# Altium project PCB_Project.PrjPcb (part 1 of 2)
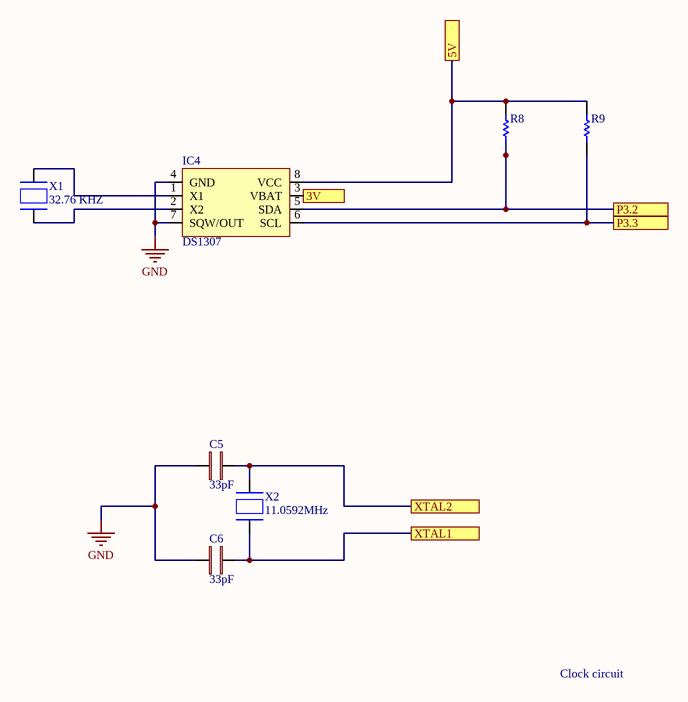
[diagram p0: Clock-management.SchDoc]
6 sheets, 57 parts. Net scope: flat (ports and power ports of the same name join across sheets).
Board file: PCB1.PcbDoc
Sheets:
  Clock-management.SchDoc
  Battery-management.SchDoc
  FTDI-support.SchDoc
  XC888.SchDoc
  Button-connections.SchDoc
  Interfaces.SchDoc

## Sheet Clock-management.SchDoc
size A4; SheetNumber: 1; SheetTotal: 6

### Parts
C5  33pF  [250R07S330JV4T]
C6  33pF  [250R07S330JV4T]
IC4  DS1307  [DS1307]
R8  RC0805FR-0710KL  [RESC2013X60X35NL10T20]  (value not drawn)
R9  RC0805FR-0710KL  [RESC2013X60X35NL10T20]  (value not drawn)
X1  32.76 KHZ  [FC-12M]
X2  11.0592MHz  [HC-49/SM]

### Ports
3V, 5V, P3.2, P3.3, XTAL1, XTAL2

### Nets
GND: C5.2 C6.2 IC4.4(GND) IC4.7(SQW/OUT)
NetBAT_1: IC4.3(VBAT) ; port 3V
NetC4_1: IC4.8(VCC) R8.2 R9.2 ; port 5V
NetC5_1: C5.1 X2.2 ; port XTAL2
NetC6_1: C6.1 X2.1 ; port XTAL1
NetIC4_1: IC4.1(X1) X1.1
NetIC4_2: IC4.2(X2) X1.2
NetIC4_5: IC4.5(SDA) R8.1 ; port P3.2
NetIC4_6: IC4.6(SCL) R9.1 ; port P3.3

### Notes on the sheet
- Clock circuit

### Library data of the parts
C5 C6 = 500R07S330JV4T: Cap Ceramic 33pF 50V C0G 5% Pad SMD 0402 125°C Ultra Low ESR T/R; Manufacturer: Johanson; Supplier 1: Newark; Manufacturer Part Number: 500R07S330JV4T; RoHS: Yes; Category: Ceramic Capacitors; Stock 1: 2779; Pricing 1: 1=0,22000, 10=0,15400, 25=0,12900, 50=0,10400, 100=0,07900 (USD); Mount: Surface Mount; Case/Package: 0402; Case Code (Metric): 1005; Case Code (Imperial): 0402; Min Operating Temperature: -55°C; Max Operating Temperature: 125°C; Dielectric: C0G; Capacitance: 33pF; Tolerance: 5%; Voltage Rating: 50V; Packaging: Tape and Reel; Voltage Rating (DC): 50V; Termination: SMD/SMT; Package Quantity: 1; Length: 1.02mm; Width: 0.02inch; Height: 0.64mm; Depth: 0.51mm; Thickness: 0.024inch; REACH SVHC: No SVHC; ComponentLink1URL: https://datasheet.ciiva.com/46417/1731432-46417670.pdf?src-supplier=Element14; ComponentLink1Description: https://datasheet.ciiva.com/46417/1731432-46417670.pdf?src-supplier=Element14; Supplier Part Number 1: 51Y5225
IC4 = DS1307ZNTR: IC RTC SERIAL 512K IND 8-SOIC; Manufacturer: Maxim; Logic Function: Clock; Time Format: HH:MM:SS; Operating Supply Voltage: 5V; Memory Size: 56B; Max Supply Voltage: 5.5V; Min Supply Voltage: 4.5V; Interface: I2C,Serial,2-Wire; Date Format: YY-MM-DD-dd; Voltage: 7V; Supplier 1: Digi-Key; Manufacturer Part Number: DS1307ZNTR; RoHS: Yes; Category: Real Time Clocks; Mount: Surface Mount; Case/Package: SOIC; Number of Pins: 8; Weight: 0.019048oz; Contact Plating: Tin,Matte; Min Operating Temperature: -40°C; Max Operating Temperature: 85°C; Packaging: Tape and Reel; Package Quantity: 2500; Series: -; Radiation Hardening: No; Lead Free: Lead Free; REACH SVHC: Unknown; ComponentLink1URL: https://datasheet.ciiva.com/1243/ds1307-1243264.pdf?src-supplier=Digi-Key; ComponentLink1Description: https://datasheet.ciiva.com/1243/ds1307-1243264.pdf?src-supplier=Digi-Key; ComponentLink2URL: https://datasheet.ciiva.com/18633/ds1307-18633131.pdf?src-supplier=Digi-Key; ComponentLink2Description: https://datasheet.ciiva.com/18633/ds1307-18633131.pdf?src-supplier=Digi-Key; ComponentLink3URL: https://datasheet.ciiva.com/3304/ds1307-3304460.pdf?src-supplier=Avnet; ComponentLink3Description: https://datasheet.ciiva.com/3304/ds1307-3304460.pdf?src-supplier=Avnet; ComponentLink4URL: https://datasheet.ciiva.com/18633/ds1307-18633132.pdf?src-supplier=Digi-Key; ComponentLink4Description: https://datasheet.ciiva.com/18633/ds1307-18633132.pdf?src-supplier=Digi-Key; ComponentLink5URL: https://datasheet.ciiva.com/28652/1647366-28652551.pdf?src-supplier=Element14; ComponentLink5Description: https://datasheet.ciiva.com/28652/1647366-28652551.pdf?src-supplier=Element14; Supplier Part Number 1: DS1307ZN+T&R-ND
R8 R9 = CMP-1659-00013-4: Chip Resistor, 10 KOhm, +/- 1%, 0.125 W, -55 to 155 degC, 0805 (2012 Metric), RoHS, Tape and Reel; Manufacturer: Yageo; Voltage Rating: 150 V; Mount: Surface Mount; ComponentLink1Description: Manufacturer URL; ComponentLink2URL: http://www.yageo.com/documents/recent/PYu-RC_Group_51_RoHS_L_04.pdf; Pins: 2; Length: 2 mm; Min Operating Temperature: -55 degC; Height: 0.5 mm; Mounting Technology: Surface Mount; RoHSCompliant: true; REACH SVHC: No SVHC; ComponentLink1URL: http://www.yageo.com/; Max Operating Temperature: 155 degC; PackageReference: 0805; DatasheetVersion: Rev. 4, 02/2016; Package Quantity: 5000; Packaging: Tape and Reel; ComponentLink2Description: Datasheet; PackageDescription: 2-Pin Surface Mounted Device, Body 2 x 1.25 mm
X1 = X1A0000610003 FC-12M 32.768KHZ 12.5PF: Crystal, FC-12M, 32.768 Khz, 12.5 Pf; Manufacturer: Epson; Load Capacitance: 12.5pF; Capacitance: 1.25E-11F; Supplier 1: Farnell; Manufacturer Part Number: X1A0000610003 FC-12M 32.768KHZ 12.5PF; RoHS: Yes; Stock 1: 2323; Pricing 1: 1=1,08000, 50=0,92000, 100=0,87600, 250=0,81700, 500=0,77000 (GBP); Mount: Surface Mount; Number of Pins: 2; Min Operating Temperature: -40°C; Max Operating Temperature: 85°C; Frequency: 32.768kHz; Packaging: Cut Tape; REACH SVHC: Unknown; ComponentLink1URL: https://datasheet.ciiva.com/48778/1734644-48778297.pdf?src-supplier=Element14; ComponentLink1Description: https://datasheet.ciiva.com/48778/1734644-48778297.pdf?src-supplier=Element14; ComponentLink2URL: https://datasheet.ciiva.com/48778/1734644-48778536.pdf?src-supplier=Element14; ComponentLink2Description: https://datasheet.ciiva.com/48778/1734644-48778536.pdf?src-supplier=Element14; ComponentLink3URL: https://datasheet.ciiva.com/48778/1734644-48778057.pdf?src-supplier=Element14; ComponentLink3Description: https://datasheet.ciiva.com/48778/1734644-48778057.pdf?src-supplier=Element14; Supplier Part Number 1: 1907468
X2 = HC49SM-11.0592-30-50-60-16-ATF: Crystal 11.0592MHz 16pF 2-Pin HC-49/U Loose; Manufacturer: Multicomp; Frequency Stability: 50ppm; Accuracy: 30ppm; Supplier 1: Newark; Manufacturer Part Number: HC49SM-11.0592-30-50-60-16-ATF; RoHS: Yes; Category: Crystals; Stock 1: 597; Pricing 1: 1=0,35400, 10=0,34000, 50=0,31600, 100=0,28300, 250=0,26100, 500=0,24300 (USD); Mount: Surface Mount; Case/Package: SMD/SMT; Number of Pins: 2; Min Operating Temperature: -10°C; Max Operating Temperature: 60°C; Load Capacitance: 16pF; Frequency: 11.0592MHz; Frequency Tolerance: 30ppm; Packaging: Cut Tape; REACH SVHC: No SVHC; ComponentLink1URL: https://datasheet.ciiva.com/8049/1661828-8049574.pdf?src-supplier=Element14; ComponentLink1Description: https://datasheet.ciiva.com/8049/1661828-8049574.pdf?src-supplier=Element14; ComponentLink2URL: https://datasheet.ciiva.com/22697/1661828-22697926.pdf?src-supplier=Element14; ComponentLink2Description: https://datasheet.ciiva.com/22697/1661828-22697926.pdf?src-supplier=Element14; Supplier Part Number 1: 33P6975

## Sheet Battery-management.SchDoc
size A4; SheetNumber: 2; SheetTotal: 6
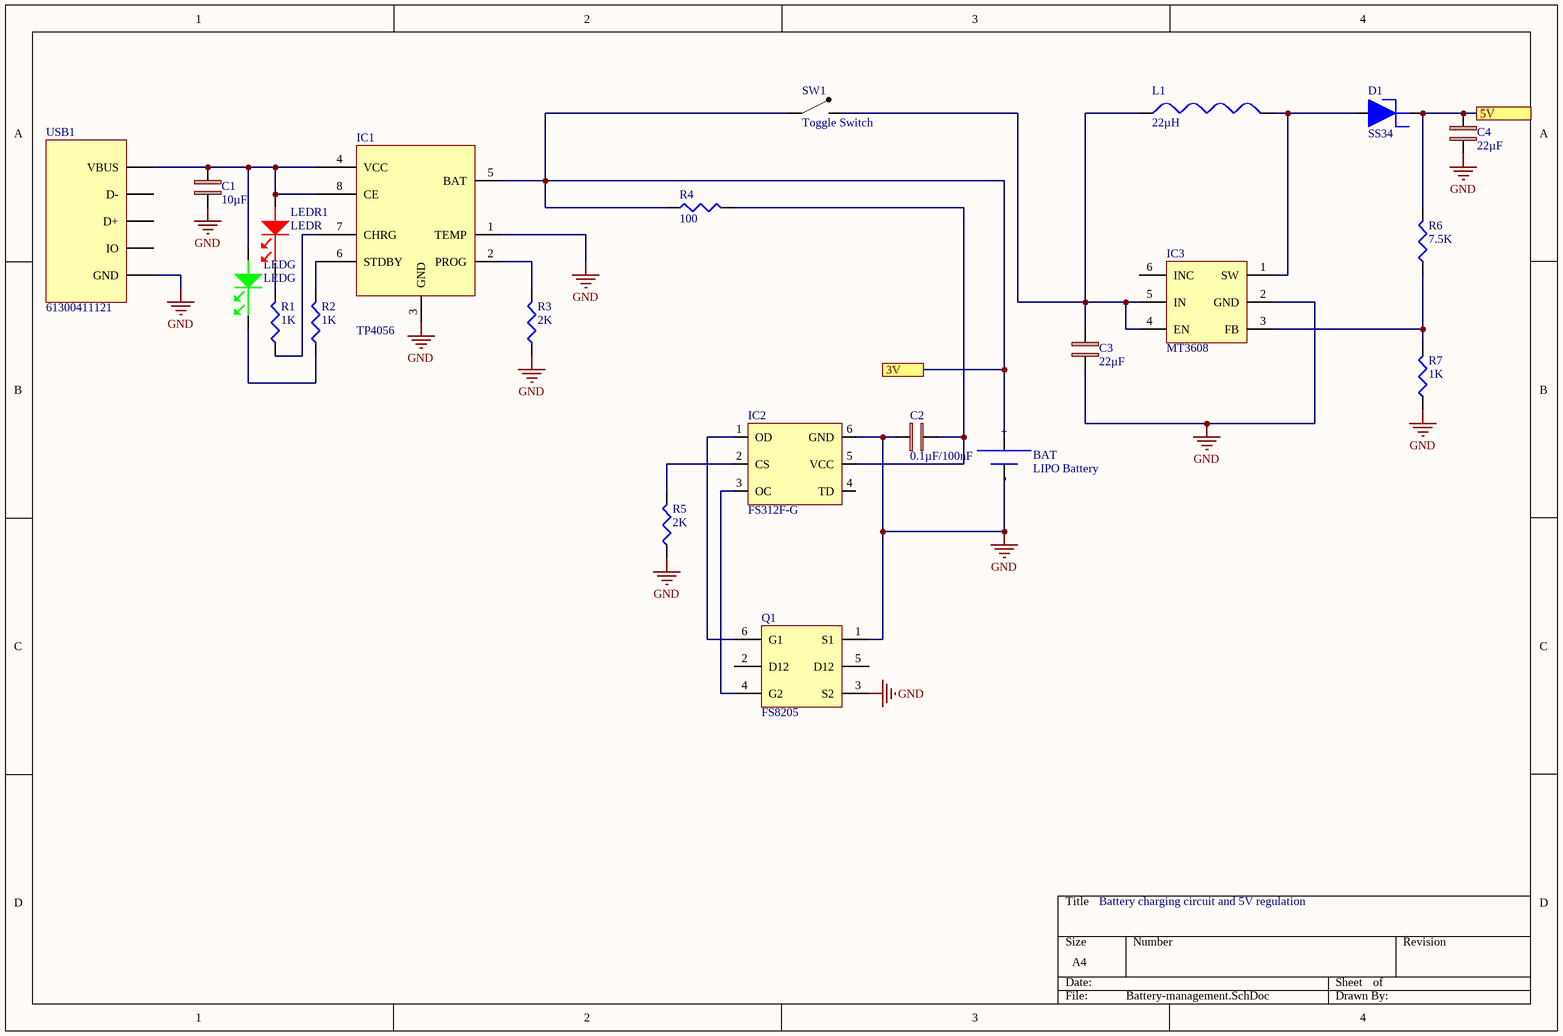
[diagram p1: Battery-management.SchDoc]

### Parts
BAT  LIPO Battery  [LIPO battery pads]
C1  10µF  [ELCO]
C2  0.1µF/100nF  [MC0603B104K250CT]
C3  22µF  [1210ZC226KAT2A]
C4  22µF  [1210ZC226KAT2A]
D1  SS34  [1N5822]
IC1  TP4056  [HSOP08]
IC2  FS312F-G  [SOT95P280X145-6N]
IC3  MT3608  [SOT23-6]
L1  22µH  [MLZ1608]
LEDG  LEDG  [KPT-3216SGC]
LEDR1  LEDR  [LSQ976-Z]
Q1  FS8205  [SOT95P280X145-6N]
R1  1K  [RK73H-0603]
R2  1K  [RK73H-0603]
R3  2K  [RC0603FR-072KL]
R4  100  [CRGP2512]
R5  2K  [RC0603FR-072KL]
R6  7.5K  [RC0603FR-072KL]
R7  1K  [RK73H-0603]
SW1  Toggle Switch  [SMD Switch]
USB1  61300411121  [Micro USB - Type B]

### Ports
3V, 5V

### Nets
GND: BAT.2(-) C1.2 C2.2 C3.2 C4.2 IC1.1(TEMP) IC1.3(GND) IC2.6(GND) IC3.2(GND) Q1.1(S1) Q1.3(S2) R3.1 R5.1 R7.1 USB1.5(GND)
NetBAT_1: BAT.1(+) IC1.5(BAT) R4.2 SW1.1 ; port 3V
NetC1_1: C1.1 IC1.4(VCC) IC1.8(CE) LEDG.1(+) LEDR1.1(+) USB1.1(VBUS)
NetC2_1: C2.1 IC2.5(VCC) R4.1
NetC3_1: C3.1 IC3.4(EN) IC3.5(IN) L1.1 SW1.2
NetC4_1: C4.1 D1.2 R6.2 ; port 5V
NetD1_1: D1.1 IC3.1(SW) L1.2
NetIC1_2: IC1.2(PROG) R3.2
NetIC1_6: IC1.6(STDBY) R2.1
NetIC1_7: IC1.7(CHRG) R1.1
NetIC2_1: IC2.1(OD) Q1.6(G1)
NetIC2_2: IC2.2(CS) R5.2
NetIC2_3: IC2.3(OC) Q1.4(G2)
NetIC3_3: IC3.3(FB) R6.1 R7.2
NetLEDG_2: LEDG.2 R2.2
NetLEDR1_2: LEDR1.2 R1.2

Not connected (* = marked no-connect by the designer): IC2 4(TD); IC3 6(INC); Q1 2(D12) 5(D12); USB1 2(D-) 3(D+) 4(IO)

### Notes on the sheet
- Battery charging circuit and 5V regulation

### Library data of the parts
BAT = 103040 LIPO battery
C1 = 35TZV10M4X6.1: RUBYCON - 35TZV10M4X6.1 - KONDENSATOR, 10µF, 35V, RADIAL, SMD; Capacitance: 10uF; Tolerance: 20%; Ripple Current: 90mA; Impedance: 1.45R; Life (Hours): 2000Hour; Supplier 1: Newark; Manufacturer: Rubycon; Manufacturer Part Number: 35TZV10M4X6.1; RoHS: Yes; Category: Aluminum Electrolytic Capacitors; Stock 1: 365; Pricing 1: 5=0,37000, 10=0,25400, 25=0,21600, 50=0,17800, 100=0,15200 (USD); Mount: Surface Mount; Case/Package: Radial; Number of Pins: 2; Min Operating Temperature: -55°C; Max Operating Temperature: 105°C; Ripple Current (AC): 90mA; Packaging: Cut Tape; Package Quantity: 2000; Voltage Rating: 35V; Voltage Rating (DC): 35V; Series: TZV; Construction: Cylindrical; Diameter: 4mm; Height: 6.1mm; Height - Seated (Max): 0.24inch; Radiation Hardening: No; REACH SVHC: No SVHC; Lead Free: Lead Free; RoHS Compliant: Yes; ComponentLink1URL: https://datasheet.ciiva.com/26878/getdatasheetpartid-443596-26878330.pdf?src-supplier=Verical; ComponentLink1Description: https://datasheet.ciiva.com/26878/getdatasheetpartid-443596-26878330.pdf?src-supplier=Verical; ComponentLink2URL: https://datasheet.ciiva.com/17514/e-tzv-17514469.pdf?src-supplier=Avnet+Europe; ComponentLink2Description: https://datasheet.ciiva.com/17514/e-tzv-17514469.pdf?src-supplier=Avnet+Europe; ComponentLink3URL: https://datasheet.ciiva.com/22732/1725814-22732219.pdf?src-supplier=Element14; ComponentLink3Description: https://datasheet.ciiva.com/22732/1725814-22732219.pdf?src-supplier=Element14; Supplier Part Number 1: 08X5009
C2 = MC0603B104K250CT: Cap Ceramic 0.1uF 25V X7R 10% Pad SMD 0603 125C T/R; Manufacturer: Multicomp; Capacitance: 100nF; Supplier 1: Newark; Manufacturer Part Number: MC0603B104K250CT; RoHS: Yes; Category: Ceramic Capacitors; Stock 1: 124000; Pricing 1: 1=0,00300, 4000=0,00300, 8000=0,00300, 20000=0,00300 (USD); Case/Package: 0603; Number of Pins: 2; Case Code (Metric): 1608; Case Code (Imperial): 0603; Min Operating Temperature: -55°C; Max Operating Temperature: 125°C; Tolerance: 10%; Packaging: Cut Tape; Voltage Rating: 25V; Dielectric: X7R; Voltage Rating (DC): 25V; Series: MLCC; Width: 0.8mm; REACH SVHC: Unknown; RoHS Compliant: Yes; ComponentLink1URL: https://datasheet.ciiva.com/22686/1901289-22686277.pdf?src-supplier=Element14; ComponentLink1Description: https://datasheet.ciiva.com/22686/1901289-22686277.pdf?src-supplier=Element14; ComponentLink2URL: https://datasheet.ciiva.com/22648/1901289-22648410.pdf?src-supplier=Element14; ComponentLink2Description: https://datasheet.ciiva.com/22648/1901289-22648410.pdf?src-supplier=Element14; Supplier Part Number 1: 94W8728
C3 C4 = 1210ZC226KAT2A: 1210 22 uF 10 V ±10 % Tolerance X7R Surface Mount Multilayer Ceramic Capacitor; Manufacturer: Kyocera AVX; Capacitance: 22uF; Tolerance: 10%; Voltage Rating: 10V; Supplier 1: Newark; Manufacturer Part Number: 1210ZC226KAT2A; RoHS: Yes; Category: Ceramic Capacitors; Stock 1: 240; Pricing 1: 1=1,79000, 10=1,46000, 25=1,36000 (USD); Mount: Surface Mount; Case/Package: 1210; Number of Pins: 2; Case Code (Imperial): 1210; Case Code (Metric): 3225; Min Operating Temperature: -55°C; Max Operating Temperature: 125°C; Dielectric: X7R; Packaging: Tape and Reel; Package Quantity: 1; Termination: SMD/SMT; Voltage Rating (DC): 10V; Series: -; Voltage: 10V; Construction: Flat; Length: 3.2mm; Width: 0.098inch; Depth: 2.5mm; Thickness: 0.11inch; Radiation Hardening: No; REACH SVHC: Unknown; Lead Free: Lead Free; RoHS Compliant: Yes; ComponentLink1URL: https://datasheet.ciiva.com/11499/cx7r-11499965.pdf?src-supplier=Avnet; ComponentLink1Description: https://datasheet.ciiva.com/11499/cx7r-11499965.pdf?src-supplier=Avnet; ComponentLink2URL: https://datasheet.ciiva.com/28592/1679506-28592703.pdf?src-supplier=Element14; ComponentLink2Description: https://datasheet.ciiva.com/28592/1679506-28592703.pdf?src-supplier=Element14; ComponentLink3URL: https://datasheet.ciiva.com/5421/cx7r-5421062.pdf?src-supplier=Mouser; ComponentLink3Description: https://datasheet.ciiva.com/5421/cx7r-5421062.pdf?src-supplier=Mouser; ComponentLink4URL: https://datasheet.ciiva.com/14887/cx7r-14887591.pdf?src-supplier=Digi-Key; ComponentLink4Description: https://datasheet.ciiva.com/14887/cx7r-14887591.pdf?src-supplier=Digi-Key; ComponentLink5URL: https://datasheet.ciiva.com/28592/1679506-28592903.pdf?src-supplier=Element14; ComponentLink5Description: https://datasheet.ciiva.com/28592/1679506-28592903.pdf?src-supplier=Element14; ComponentLink6URL: https://datasheet.ciiva.com/14887/cx7r-14887593.pdf?src-supplier=Digi-Key; ComponentLink6Description: https://datasheet.ciiva.com/14887/cx7r-14887593.pdf?src-supplier=Digi-Key; ComponentLink7URL: https://datasheet.ciiva.com/7614/cx7r-7614701.pdf?src-supplier=Digi-Key; ComponentLink7Description: https://datasheet.ciiva.com/7614/cx7r-7614701.pdf?src-supplier=Digi-Key; ComponentLink8URL: https://datasheet.ciiva.com/11499/cx7r-11499966.pdf?src-supplier=Avnet; ComponentLink8Description: https://datasheet.ciiva.com/11499/cx7r-11499966.pdf?src-supplier=Avnet; ComponentLink9URL: https://datasheet.ciiva.com/16301/cx7r-16301534.pdf?src-supplier=Future+Electronics; ComponentLink9Description: https://datasheet.ciiva.com/16301/cx7r-16301534.pdf?src-supplier=Future+Electronics; Supplier Part Number 1: 95W9441
D1 = SS34-E3/57T: DIODE SCHOTTKY 40V 3A DO214AB; Manufacturer: Vishay Semiconductors; Forward Voltage: 500mV; Element Configuration: Single; Max Forward Surge Current (Ifsm): 100A; Max Reverse Current: 500uA; Polarity: Standard; Supplier 1: RSComponents; Manufacturer Part Number: SS34-E3/57T; RoHS: Yes; Category: Rectifier Diodes; Stock 1: 1120; Pricing 1: 20=0,52900, 180=0,38200, 420=0,36100 (USD); Mount: Surface Mount; Case/Package: SMC; Number of Pins: 2; Contact Plating: Tin,Matte; Min Operating Temperature: -55°C; Max Operating Temperature: 125°C; Packaging: Tape and Reel; Forward Current: 3A; Max Repetitive Reverse Voltage (Vrrm): 40V; Max Surge Current: 100A; Package Quantity: 1; Average Rectified Current: 3A; Max Reverse Leakage Current: 500uA; Peak Non-Repetitive Surge Current: 100A; Voltage Rating (DC): 40V; Current Rating: 3A; Output Current: 3A; Current: 3A; Voltage: 40V; Max Reverse Voltage (DC): 40V; Length: 7.11mm; Width: 6.22mm; Height: 2.417mm; Radiation Hardening: No; REACH SVHC: Unknown; Lead Free: Lead Free; ComponentLink1URL: https://datasheet.ciiva.com/15144/getdatasheetpartid-73598-15144471.pdf?src-supplier=Verical; ComponentLink1Description: https://datasheet.ciiva.com/15144/getdatasheetpartid-73598-15144471.pdf?src-supplier=Verical; ComponentLink2URL: https://datasheet.ciiva.com/4244/ss32-4244863.pdf?src-supplier=Arrow+Electronics; ComponentLink2Description: https://datasheet.ciiva.com/4244/ss32-4244863.pdf?src-supplier=Arrow+Electronics; ComponentLink3URL: https://datasheet.ciiva.com/17077/ss34-e3-57t-17077951.pdf?src-supplier=Allied+Electronics; ComponentLink3Description: https://datasheet.ciiva.com/17077/ss34-e3-57t-17077951.pdf?src-supplier=Allied+Electronics; ComponentLink4URL: https://datasheet.ciiva.com/26788/ss34-e3-57t-26788786.pdf?src-supplier=IIIC; ComponentLink4Description: https://datasheet.ciiva.com/26788/ss34-e3-57t-26788786.pdf?src-supplier=IIIC; ComponentLink5URL: https://datasheet.ciiva.com/26295/1697107-26295413.pdf?src-supplier=Element14; ComponentLink5Description: https://datasheet.ciiva.com/26295/1697107-26295413.pdf?src-supplier=Element14
IC2 = FS312F-G: Lithium battery protection IC; Category: Protection IC; Case/Package: SOT23-6
IC3 = MT3608: Voltage regulator; Case/Package: SOT23-6; Category: Voltage regulator
L1 = MLZ1608N220LT000: Inductor Power Shielded Multi-Layer 22uH 20% 2MHz Ferrite 0.05A 2.145Ohm DCR 0603 T/R; Manufacturer: TDK; Saturation Current: 50mA; DC Resistance (DCR): 2.145R; Current Rating: 300mA; Supplier 1: Arrow Electronics; Manufacturer Part Number: MLZ1608N220LT000; RoHS: Yes; Category: Fixed Inductors; Stock 1: 3800; Pricing 1: 1=0,15380, 10=0,10450, 25=0,10350, 100=0,08320, 250=0,08240, 500=0,07410, 1000=0,06230, 3000=0,06170 (USD); Mount: Surface Mount; Case/Package: 0603; Case Code (Metric): 1608; Case Code (Imperial): 0603; Core Material: Ferrite; Weight: 0.000141oz; Min Operating Temperature: -55°C; Max Operating Temperature: 125°C; Packaging: Tape and Reel; Inductance: 22uH; Package Quantity: 4000; Tolerance: 20%; Shielding: Shielded; Test Frequency: 2MHz; Termination: SMD/SMT; Length: 0.063inch; Width: 0.031inch; Height: 0.8mm; Height - Seated (Max): 0.037inch; Lead Free: Lead Free; RoHS Compliant: Yes; ComponentLink1URL: https://datasheet.ciiva.com/41832/inductor-commercial-decoupling-mlz-en-41832797.pdf?src-supplier=Digi-Key; ComponentLink1Description: https://datasheet.ciiva.com/41832/inductor-commercial-decoupling-mlz-en-41832797.pdf?src-supplier=Digi-Key; Supplier Part Number 1: MLZ1608N220LT000
LEDG = KPT-3216SGC: LED Uni-Color SB. Green 565nm 2-Pin Chip LED T/R; Manufacturer: Kingbright; Lens Color: Clear; Lens Style: Rectangular,Diffused,Colorless; Viewing Angle: 120°; Number of LEDs: 1; Luminous Intensity: 12mcd; Forward Voltage: 2.2V; Wavelength: 568nm; Forward Current: 20mA; Supplier 1: RSComponents; Manufacturer Part Number: KPT-3216SGC; RoHS: Yes; Category: LEDs; Stock 1: 1; Pricing 1: 100=0,14200, 500=0,13500, 1000=0,11800, 2000=0,10700, 8000=0,10500 (USD); Mount: Surface Mount; Case/Package: 3216; Number of Pins: 2; Color: Green; Packaging: Tape and Reel; Dominant Wavelength: 568nm; Series: 1206; Radiation Hardening: No; REACH SVHC: No SVHC; RoHS Compliant: Yes; ComponentLink1URL: https://datasheet.ciiva.com/23674/1563720-23674567.pdf?src-supplier=Newark; ComponentLink1Description: https://datasheet.ciiva.com/23674/1563720-23674567.pdf?src-supplier=Newark; Supplier Part Number 1: 8610204P
LEDR1 = LSQ976-Z: Led, SMD, Red, 180MCD, 633NM; Manufacturer: Osram Opto; Forward Current: 20mA; Viewing Angle: 160°; Forward Voltage: 2V; Lens Style: Rectangular,Diffused,Colorless; Number of LEDs: 1; Supplier 1: Avnet; Manufacturer Part Number: LSQ976-Z; RoHS: Yes; Category: LEDs; Mount: Surface Mount; Number of Pins: 2; Color: Red; Dominant Wavelength: 633nm; Wavelength: 633nm; Luminous Intensity: 180mcd; Packaging: Cut Tape; REACH SVHC: No SVHC; ComponentLink1URL: https://datasheet.ciiva.com/8060/24682-8060069.pdf?src-supplier=Element14; ComponentLink1Description: https://datasheet.ciiva.com/8060/24682-8060069.pdf?src-supplier=Element14; ComponentLink2URL: https://datasheet.ciiva.com/8060/24682-8060070.pdf?src-supplier=Element14; ComponentLink2Description: https://datasheet.ciiva.com/8060/24682-8060070.pdf?src-supplier=Element14; Supplier Part Number 1: LSQ976-Z
Q1 = FS8205: Dual N-Channel Enhancement Mode Power MOSFET; Case/Package: SOT23-6
R1 R2 R7 = RK73H1JTTD1001F: 1KΩ ±1% 1/8W ±100ppm/℃ 0603; Manufacturer: KOA Speer; Voltage Rating: 75V; Power Rating: 125mW; Resistance: 1kR; Temperature Coefficient: 100ppm/°C; Voltage Rating (DC): 50V; Supplier 1: Arrow Electronics; Manufacturer Part Number: RK73H1JTTD1001F; RoHS: Yes; Category: Resistors; Stock 1: 1; Pricing 1: 1=0,04800 (USD); Case/Package: 0603; Number of Pins: 2; Case Code (Imperial): 0603; Case Code (Metric): 1608; Weight: 0.000811oz; Min Operating Temperature: -55°C; Max Operating Temperature: 155°C; Packaging: Cut Tape; Package Quantity: 5000; Tolerance: 1%; Resistor Type: Thick Film; Termination: SMD/SMT; Series: RK73H; Technology: THICK FILM; Length: 1.6mm; Width: 0.8mm; Height: 0.45mm; Depth: 0.8mm; Military Standard: Not; REACH SVHC: Unknown; Lead Free: Lead Free; RoHS Compliant: Yes; ComponentLink1URL: https://datasheet.ciiva.com/15159/getdatasheetpartid-87490-15159861.pdf?src-supplier=Verical; ComponentLink1Description: https://datasheet.ciiva.com/15159/getdatasheetpartid-87490-15159861.pdf?src-supplier=Verical; ComponentLink2URL: https://datasheet.ciiva.com/48426/rk73h-series-eng-jap-tds-48426519.pdf?src-supplier=Distrelec; ComponentLink2Description: https://datasheet.ciiva.com/48426/rk73h-series-eng-jap-tds-48426519.pdf?src-supplier=Distrelec; Supplier Part Number 1: RK73H1JTTD1001F
R3 R5 = RC0603FR-072KL: 2000Ω ± 1.00% 0.1W ± 100ppm/℃ 0603; Manufacturer: Yageo; Resistance: 2kR; Tolerance: 1%; Temperature Coefficient: 100ppm/°C; Voltage Rating (DC): 50V; Power Rating: 100mW; Working Voltage: 75V; Supplier 1: RSComponents; Manufacturer Part Number: RC0603FR-072KL; RoHS: Yes; Category: Resistors; Stock 1: 1700; Pricing 1: 5000=0,00400, 10000=0,00300, 15000=0,00300, 20000=0,00300 (GBP); Case/Package: 0603; Number of Pins: 2; Case Code (Metric): 1608; Case Code (Imperial): 0603; Min Operating Temperature: -55°C; Max Operating Temperature: 155°C; Resistor Type: Thick Film; Packaging: Tape and Reel; Voltage Rating: 50V; Package Quantity: 1; Number of Terminations: 2; Termination: SMD/SMT; Max Power Dissipation: 100mW; Features: Moisture Resistant; Series: RC; Resistance Tolerance: 1%; Technology: THICK FILM; Construction: Rectangular; Length: 1.6mm; Width: 0.031inch; Height: 0.45mm; Depth: 0.8mm; Lead Free: Lead Free; REACH SVHC: No SVHC; Military Standard: Not; RoHS Compliant: Yes; ComponentLink1URL: https://datasheet.ciiva.com/11808/0900766b80f96399-11808134.pdf?src-supplier=RSComponents; ComponentLink1Description: https://datasheet.ciiva.com/11808/0900766b80f96399-11808134.pdf?src-supplier=RSComponents; ComponentLink2URL: https://datasheet.ciiva.com/22747/443971-22747526.pdf?src-supplier=Element14; ComponentLink2Description: https://datasheet.ciiva.com/22747/443971-22747526.pdf?src-supplier=Element14; ComponentLink3URL: https://datasheet.ciiva.com/2453/pyu-r-int-thick-7-2453913.pdf?src-supplier=Digi-Key; ComponentLink3Description: https://datasheet.ciiva.com/2453/pyu-r-int-thick-7-2453913.pdf?src-supplier=Digi-Key; ComponentLink4URL: https://datasheet.ciiva.com/12555/rc0603-272842-12555257.pdf?src-supplier=Mouser; ComponentLink4Description: https://datasheet.ciiva.com/12555/rc0603-272842-12555257.pdf?src-supplier=Mouser; ComponentLink5URL: https://datasheet.ciiva.com/2453/pyu-r-int-thick-7-2453914.pdf?src-supplier=Digi-Key; ComponentLink5Description: https://datasheet.ciiva.com/2453/pyu-r-int-thick-7-2453914.pdf?src-supplier=Digi-Key; ComponentLink6URL: https://datasheet.ciiva.com/2453/pyu-r-int-thick-7-2453915.pdf?src-supplier=Digi-Key; ComponentLink6Description: https://datasheet.ciiva.com/2453/pyu-r-int-thick-7-2453915.pdf?src-supplier=Digi-Key; Supplier Part Number 1: 1995523
R4 = CRGP2512F100R: Res Thick Film 2512 100 Ohm 1% 2W ±100ppm/C Pad SMD T/R; Manufacturer: TE Connectivity; Resistance: 100R; Temperature Coefficient: 200ppm/°C; Supplier 1: RSComponents; Manufacturer Part Number: CRGP2512F100R; RoHS: Yes; Category: Resistors; Stock 1: 1; Pricing 1: 4000=0,10900, 12000=0,10100, 20000=0,09100 (USD); Case/Package: 2512; Case Code (Imperial): 2512; Case Code (Metric): 6432; Min Operating Temperature: -55°C; Max Operating Temperature: 155°C; Resistor Type: Thick Film; Packaging: Cut Tape; Tolerance: 1%; Max Power Dissipation: 2W; Number of Terminations: 2; RoHS Compliant: Yes; ComponentLink1URL: https://4donline.ihs.com/images/VipMasterIC/IC/TYEL/TYEL-S-A0005460475/TYEL-S-A0005460475-1.pdf?hkey=52A5661711E402568146F3353EA87419&src-supplier=Farnell; ComponentLink1Description: https://4donline.ihs.com/images/VipMasterIC/IC/TYEL/TYEL-S-A0005460475/TYEL-S-A0005460475-1.pdf?hkey=52A5661711E402568146F3353EA87419&src-supplier=Farnell; ComponentLink2URL: https://www.te.com/commerce/DocumentDelivery/DDEController?Action=srchrtrv&amp;DocNm=9-1773463-9&amp;DocType=DS&amp;DocLang=English&src-supplier=Digi-Key; ComponentLink2Description: https://www.te.com/commerce/DocumentDelivery/DDEController?Action=srchrtrv&amp;DocNm=9-1773463-9&amp;DocType=DS&amp;DocLang=English&src-supplier=Digi-Key; ComponentLink3URL: https://4donline.ihs.com/images/VipMasterIC/IC/TYEL/TYEL-S-A0005460475/TYEL-S-A0005460475-1.pdf?hkey=52A5661711E402568146F3353EA87419&src-supplier=Newark; ComponentLink3Description: https://4donline.ihs.com/images/VipMasterIC/IC/TYEL/TYEL-S-A0005460475/TYEL-S-A0005460475-1.pdf?hkey=52A5661711E402568146F3353EA87419&src-supplier=Newark; Supplier Part Number 1: 1764326
R6 = RC0603FR-077K5L: 7500Ω ± 1.00% 0.1W ± 100ppm/℃ 0603; Manufacturer: Yageo; Resistance: 7.5kR; Power Rating: 100mW; Tolerance: 1%; Voltage Rating: 50V; Temperature Coefficient: 100ppm/°C; Working Voltage: 75V; Supplier 1: Newark; Manufacturer Part Number: RC0603FR-077K5L; RoHS: Yes; Category: Chip SMD Resistors; Stock 1: 2709; Pricing 1: 1=0,10000, 25=0,01800, 50=0,01300, 100=0,00700 (USD); Case/Package: 0603; Number of Pins: 2; Case Code (Metric): 1608; Case Code (Imperial): 0603; Min Operating Temperature: -55°C; Max Operating Temperature: 155°C; Package Quantity: 1; Packaging: Tape and Reel; Resistor Type: Thick Film; Number of Terminations: 2; Termination: SMD/SMT; Max Power Dissipation: 100mW; Voltage Rating (DC): 50V; Features: Moisture Resistant; Series: RC; Technology: THICK FILM; Construction: Rectangular; Resistance Tolerance: 1%; Length: 1.6mm; Width: 0.031inch; Height: 0.45mm; Depth: 0.8mm; RoHS Compliant: Yes; REACH SVHC: No SVHC; Military Standard: Not; Lead Free: Lead Free; ComponentLink1URL: https://datasheet.ciiva.com/11808/0900766b80f96399-11808401.pdf?src-supplier=RSComponents; ComponentLink1Description: https://datasheet.ciiva.com/11808/0900766b80f96399-11808401.pdf?src-supplier=RSComponents; ComponentLink2URL: https://datasheet.ciiva.com/2519/pyu-r-int-thick-7-2519120.pdf?src-supplier=Digi-Key; ComponentLink2Description: https://datasheet.ciiva.com/2519/pyu-r-int-thick-7-2519120.pdf?src-supplier=Digi-Key; ComponentLink3URL: https://datasheet.ciiva.com/12555/rc0603-272842-12555256.pdf?src-supplier=Mouser; ComponentLink3Description: https://datasheet.ciiva.com/12555/rc0603-272842-12555256.pdf?src-supplier=Mouser; ComponentLink4URL: https://datasheet.ciiva.com/46395/443971-46395019.pdf?src-supplier=Element14; ComponentLink4Description: https://datasheet.ciiva.com/46395/443971-46395019.pdf?src-supplier=Element14; ComponentLink5URL: https://datasheet.ciiva.com/2519/pyu-r-int-thick-7-2519121.pdf?src-supplier=Digi-Key; ComponentLink5Description: https://datasheet.ciiva.com/2519/pyu-r-int-thick-7-2519121.pdf?src-supplier=Digi-Key; ComponentLink6URL: https://datasheet.ciiva.com/2519/pyu-r-int-thick-7-2519122.pdf?src-supplier=Digi-Key; ComponentLink6Description: https://datasheet.ciiva.com/2519/pyu-r-int-thick-7-2519122.pdf?src-supplier=Digi-Key; ComponentLink7URL: https://datasheet.ciiva.com/15189/getdatasheetpartid-326523-15189821.pdf?src-supplier=Verical; ComponentLink7Description: https://datasheet.ciiva.com/15189/getdatasheetpartid-326523-15189821.pdf?src-supplier=Verical; Supplier Part Number 1: 68R0113
SW1 = SK12D07VG3NS: C&K SK-12D07-VG 3 NS Switches > Slide > Miniature > Mini R/A Slide; Manufacturer: ITT C&K; Supplier 1: Digi-Key; Manufacturer Part Number: SK12D07VG3NS; RoHS: No; Category: Uncategorized; Pricing 1: 30000=0,24375 (USD); Package Quantity: 1000; ComponentLink1URL: http://www.mouser.com/ds/2/60/sk-965380.pdf?src-supplier=Mouser; ComponentLink1Description: http://www.mouser.com/ds/2/60/sk-965380.pdf?src-supplier=Mouser; ComponentLink2URL: https://www.ckswitches.com/media/1432/sk.pdf?src-supplier=Digi-Key; ComponentLink2Description: https://www.ckswitches.com/media/1432/sk.pdf?src-supplier=Digi-Key; Supplier Part Number 1: SK12D07VG3NS-ND
USB1 = 61300411121: CONN HEADER 4 POS 2.54; Manufacturer: Wurth Electronics; Number of Contacts: 4; Gender: Male; Connector Type: Male Pin; Pitch: 0.1inch; Supplier 1: RSComponents; Manufacturer Part Number: 61300411121; RoHS: Yes; Category: Headers and Wire Housings; Stock 1: 380; Pricing 1: 5=0,19600, 250=0,08000, 500=0,07800, 2500=0,07500, 5000=0,07200 (USD); Mount: Through Hole; Contact Material: Copper; Color: Black; Contact Plating: Gold; Number of Rows: 1; Packaging: Bulk; Termination: Solder; Number of Positions: 4; Contact Mating Length: 0.236inch; REACH SVHC: Unknown; RoHS Compliant: Yes; Lead Free: Lead Free; ComponentLink1URL: http://www.farnell.com/cad/1737268.pdf?src-supplier=Element14; ComponentLink1Description: http://www.farnell.com/cad/1737268.pdf?src-supplier=Element14; ComponentLink2URL: https://katalog.we-online.de/em/datasheet/6130xx11121.pdf?src-supplier=Digi-Key; ComponentLink2Description: https://katalog.we-online.de/em/datasheet/6130xx11121.pdf?src-supplier=Digi-Key; Supplier Part Number 1: 8281594
IC1 = TP4056: Category: Battery Management; Case/Package: ESOP8

## Sheet FTDI-support.SchDoc
size A4; SheetNumber: 3; SheetTotal: 6
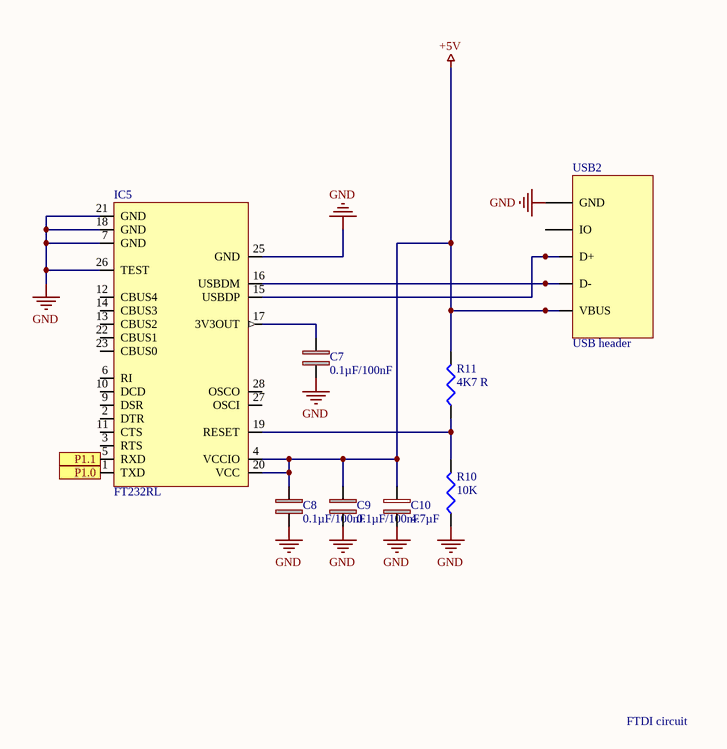
[diagram p2: FTDI-support.SchDoc]

### Parts
C7  0.1µF/100nF  [MC0603B104K250CT]
C8  0.1µF/100nF  [MC0603B104K250CT]
C9  0.1µF/100nF  [MC0603B104K250CT]
C10  4.7µF  [TMCUA1C475KTRF]
IC5  FT232RL  [SSOP28]
R10  10K  [RC0805]
R11  4K7 R  [PCF0603]
USB2  USB header  [Micro USB - Type B]

### Ports
P1.0, P1.1

### Nets
+5V: C8.1 C9.1 C10.2(+) IC5.4(VCCIO) IC5.20(VCC) R11.2 USB2.1(VBUS)
GND: C7.2 C8.2 C9.2 C10.1 IC5.7(GND) IC5.18(GND) IC5.21(GND) IC5.25(GND) IC5.26(TEST) R10.1 USB2.5(GND)
NetC7_1: C7.1 IC5.17(3V3OUT)
NetIC5_1: IC5.1(TXD) ; port P1.0
NetIC5_5: IC5.5(RXD) ; port P1.1
NetIC5_15: IC5.15(USBDP) USB2.3(D+)
NetIC5_16: IC5.16(USBDM) USB2.2(D-)
NetIC5_19: IC5.19(RESET) R10.2 R11.1

Not connected (* = marked no-connect by the designer): IC5 2(DTR) 3(RTS) 6(RI) 9(DSR) 10(DCD) 11(CTS) 12(CBUS4) 13(CBUS2) 14(CBUS3) 22(CBUS1) 23(CBUS0) 27(OSCI) 28(OSCO); USB2 4(IO)

### Notes on the sheet
- FTDI circuit

### Library data of the parts
C7-C9 = MC0603B104K250CT: as C2 on sheet Battery-management; Supplier 1: Newark; Manufacturer Part Number: MC0603B104K250CT; RoHS: Yes; Category: Ceramic Capacitors; Stock 1: 124000; Pricing 1: 1=0,00300, 4000=0,00300, 8000=0,00300, 20000=0,00300 (USD); Case/Package: 0603; Number of Pins: 2; Case Code (Metric): 1608; Case Code (Imperial): 0603; Min Operating Temperature: -55°C; Max Operating Temperature: 125°C; Tolerance: 10%; Packaging: Cut Tape; Voltage Rating: 25V; Dielectric: X7R; Voltage Rating (DC): 25V; Series: MLCC; Width: 0.8mm; REACH SVHC: Unknown; RoHS Compliant: Yes; ComponentLink1URL: https://datasheet.ciiva.com/22686/1901289-22686277.pdf?src-supplier=Element14; ComponentLink1Description: https://datasheet.ciiva.com/22686/1901289-22686277.pdf?src-supplier=Element14; ComponentLink2URL: https://datasheet.ciiva.com/22648/1901289-22648410.pdf?src-supplier=Element14; ComponentLink2Description: https://datasheet.ciiva.com/22648/1901289-22648410.pdf?src-supplier=Element14; Supplier Part Number 1: 94W8728
C10 = TMCUA1C475KTRF: Cap Tant Solid 4.7uF 16V UA CASE 10% (3.2 X 1.6 X 1.2mm) Inward L SMD 3216-12 4 Ohm 125C T/R; Manufacturer: Vishay; ESR (Equivalent Series Resistance): 4R; Case/Category: 1206; Supplier 1: RSComponents; Manufacturer Part Number: TMCUA1C475KTRF; RoHS: Yes; Category: Tantalum Capacitors; Stock 1: 1; Pricing 1: 3000=0,10600, 6000=0,10300 (USD); Mount: Surface Mount; Case Code (Metric): 3216; Case Code (Imperial): 1206; Min Operating Temperature: -55°C; Max Operating Temperature: 125°C; Capacitance: 4.7uF; Voltage Rating: 16V; Packaging: Cut Tape; Tolerance: 10%; Voltage Rating (DC): 16V; REACH SVHC: Unknown; RoHS Compliant: Yes; ComponentLink1URL: http://www.farnell.com/datasheets/1948249.pdf?src-supplier=Farnell; ComponentLink1Description: http://www.farnell.com/datasheets/1948249.pdf?src-supplier=Farnell; ComponentLink2URL: http://www.farnell.com/datasheets/1948249.pdf?src-supplier=Element14; ComponentLink2Description: http://www.farnell.com/datasheets/1948249.pdf?src-supplier=Element14; Supplier Part Number 1: 1882042
IC5 = FT232RL: Usb Interface Ics Usb to Serial Uart 28 Pin SSOP; Manufacturer: FTDI; Min Supply Voltage: 1.8V; Max Supply Voltage: 5.25V; Data Rate: 3Mbps; Number of Drivers: 1; Voltage: 5V; Bandwidth: 48MHz; Nominal Supply Current: 15mA; Supplier 1: RSComponents; Manufacturer Part Number: FT232RL; RoHS: No; Category: Interface ICs; Stock 1: 12; Pricing 1: 1=4,97300, 20=4,11500, 100=3,90000, 500=3,61900, 1000=3,55200 (USD); Mount: Surface Mount; Case/Package: SSOP; Number of Pins: 28; Min Operating Temperature: -40°C; Max Operating Temperature: 85°C; Packaging: Cut Tape; Interface: UART; Number of Receivers: 1; Length: 10.2mm; Width: 5.3mm; Height: 1.75mm; REACH SVHC: No SVHC; Lead Free: Lead Free; ComponentLink1URL: https://datasheet.ciiva.com/14094/ft232r-eng-tds-14094039.pdf?src-supplier=Distrelec; ComponentLink1Description: https://datasheet.ciiva.com/14094/ft232r-eng-tds-14094039.pdf?src-supplier=Distrelec; Supplier Part Number 1: 0406580
R10 = RC0805FR-0710KL: Res SMD 0805 10K 1% 0.125W T.C.100PPM; Manufacturer: Yageo; Resistance: 10kR; Power Rating: 125mW; Voltage Rating: 150V; Temperature Coefficient: 100ppm/°C; Supplier 1: RSComponents; Manufacturer Part Number: RC0805FR-0710KL; RoHS: Yes; Category: Resistors; Stock 1: 435000; Pricing 1: 5000=0,00700 (USD); Case/Package: 0805; Case Code (Imperial): 0805; Case Code (Metric): 2012; Size Code: 0805; Min Operating Temperature: -55°C; Max Operating Temperature: 155°C; Packaging: Tape and Reel; Tolerance: 1%; Package Quantity: 1; Termination: SMD/SMT; Max Power Dissipation: 125mW; Resistor Type: Thick Film; Number of Terminations: 2; Series: RC; Construction: Rectangular; Resistance Tolerance: 1%; Technology: THICK FILM; Features: Moisture Resistant; Length: 2mm; Width: 0.049inch; Height: 0.024inch; Depth: 1.25mm; REACH SVHC: Unknown; Lead Free: Lead Free; Military Standard: Not; RoHS Compliant: Yes; ComponentLink1URL: https://datasheet.ciiva.com/11808/0900766b8106beab-11808151.pdf?src-supplier=RSComponents; ComponentLink1Description: https://datasheet.ciiva.com/11808/0900766b8106beab-11808151.pdf?src-supplier=RSComponents; ComponentLink2URL: https://datasheet.ciiva.com/12669/rc0805-12669688.pdf?src-supplier=Mouser; ComponentLink2Description: https://datasheet.ciiva.com/12669/rc0805-12669688.pdf?src-supplier=Mouser; ComponentLink3URL: https://datasheet.ciiva.com/46447/444164-46447563.pdf?src-supplier=Element14; ComponentLink3Description: https://datasheet.ciiva.com/46447/444164-46447563.pdf?src-supplier=Element14; ComponentLink4URL: https://datasheet.ciiva.com/2456/pyu-r-int-thick-7-2456972.pdf?src-supplier=Digi-Key; ComponentLink4Description: https://datasheet.ciiva.com/2456/pyu-r-int-thick-7-2456972.pdf?src-supplier=Digi-Key; ComponentLink5URL: https://datasheet.ciiva.com/2456/pyu-r-int-thick-7-2456973.pdf?src-supplier=Digi-Key; ComponentLink5Description: https://datasheet.ciiva.com/2456/pyu-r-int-thick-7-2456973.pdf?src-supplier=Digi-Key; ComponentLink6URL: https://datasheet.ciiva.com/2456/pyu-r-int-thick-7-2456974.pdf?src-supplier=Digi-Key; ComponentLink6Description: https://datasheet.ciiva.com/2456/pyu-r-int-thick-7-2456974.pdf?src-supplier=Digi-Key; ComponentLink7URL: https://datasheet.ciiva.com/16747/rc0805-16747087.pdf?src-supplier=Future+Electronics; ComponentLink7Description: https://datasheet.ciiva.com/16747/rc0805-16747087.pdf?src-supplier=Future+Electronics; Supplier Part Number 1: 6185163; Parameter 1: *
R11 = PCF0603P-R-4K7-BT1: Surface Mount Metal Film Resistor, Pcf Series, 4.7 Kohm, 63 Mw, - 0.1%, 75 V Rohs Compliant: Yes; Manufacturer: TT Welwyn; Power Rating: 63mW; Voltage Rating: 75V; Resistance: 4.7kR; Temperature Coefficient: 25ppm/°C; Case/Category: 0603; Supplier 1: Newark; Manufacturer Part Number: PCF0603P-R-4K7-BT1; RoHS: Yes; Category: Chip SMD Resistors; Stock 1: 1027; Pricing 1: 10=0,17900 (USD); Case Code (Imperial): 0603; Case Code (Metric): 1608; Tolerance: 0.1%; Packaging: Cut Tape; Resistor Type: Thin Film; Voltage Rating (DC): 75V; REACH SVHC: No SVHC; ComponentLink1URL: https://datasheet.ciiva.com/7860/3754-7860191.pdf?src-supplier=Element14; ComponentLink1Description: https://datasheet.ciiva.com/7860/3754-7860191.pdf?src-supplier=Element14; ComponentLink2URL: https://datasheet.ciiva.com/6093/3754-6093381.pdf?src-supplier=Farnell; ComponentLink2Description: https://datasheet.ciiva.com/6093/3754-6093381.pdf?src-supplier=Farnell; Supplier Part Number 1: 61M8292
USB2 = 61300411121: as USB1 on sheet Battery-management; Supplier 1: RSComponents; Manufacturer Part Number: 61300411121; RoHS: Yes; Category: Headers and Wire Housings; Stock 1: 380; Pricing 1: 5=0,19600, 250=0,08000, 500=0,07800, 2500=0,07500, 5000=0,07200 (USD); Mount: Through Hole; Contact Material: Copper; Color: Black; Contact Plating: Gold; Number of Rows: 1; Packaging: Bulk; Termination: Solder; Number of Positions: 4; Contact Mating Length: 0.236inch; REACH SVHC: Unknown; RoHS Compliant: Yes; Lead Free: Lead Free; ComponentLink1URL: http://www.farnell.com/cad/1737268.pdf?src-supplier=Element14; ComponentLink1Description: http://www.farnell.com/cad/1737268.pdf?src-supplier=Element14; ComponentLink2URL: https://katalog.we-online.de/em/datasheet/6130xx11121.pdf?src-supplier=Digi-Key; ComponentLink2Description: https://katalog.we-online.de/em/datasheet/6130xx11121.pdf?src-supplier=Digi-Key; Supplier Part Number 1: 8281594

## Sheet XC888.SchDoc
size A4; SheetNumber: 4; SheetTotal: 6
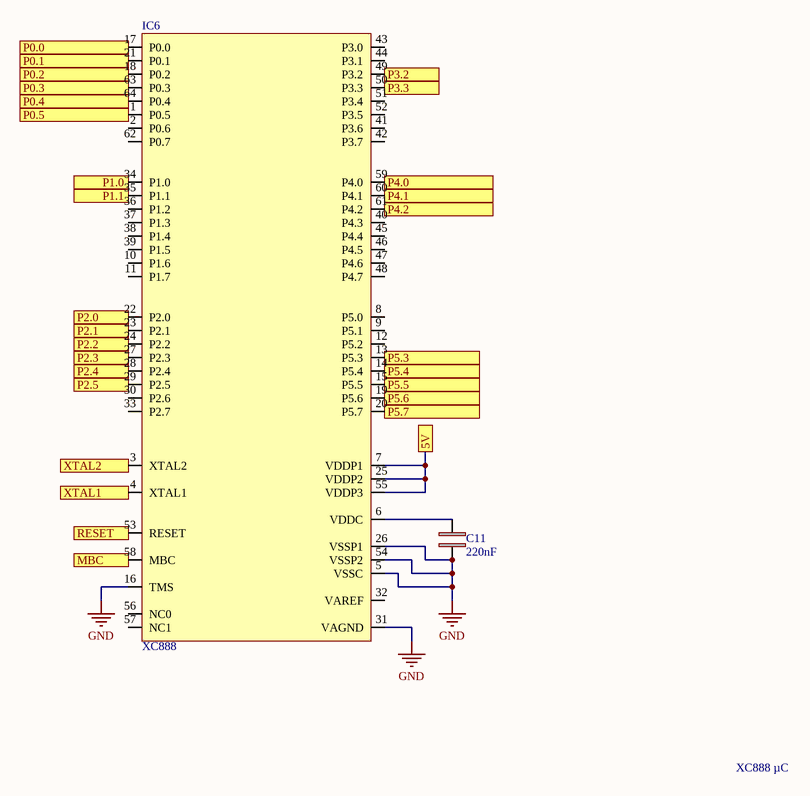
[diagram p3: XC888.SchDoc]

### Parts
C11  220nF  [C0805C224K5RACTU]
IC6  XC888  [XC888 - 3]

### Ports
5V, MBC, P0.0, P0.1, P0.2, P0.3, P0.4, P0.5, P1.0, P1.1, P2.0, P2.1, P2.2, P2.3, P2.4, P2.5, P3.2, P3.3, P4.0, P4.1, P4.2, P5.3, P5.4, P5.5, P5.6, P5.7, RESET, XTAL1, XTAL2

### Nets
GND: C11.2 IC6.5(VSSC) IC6.16(TMS) IC6.26(VSSP1) IC6.31(VAGND) IC6.54(VSSP2)
NetC4_1: IC6.7(VDDP1) IC6.25(VDDP2) IC6.55(VDDP3) ; port 5V
NetC5_1: IC6.3(XTAL2) ; port XTAL2
NetC6_1: IC6.4(XTAL1) ; port XTAL1
NetC11_1: C11.1 IC6.6(VDDC)
NetC12_1: IC6.53(RESET) ; port RESET
NetIC4_5: IC6.49(P3.2) ; port P3.2
NetIC4_6: IC6.50(P3.3) ; port P3.3
NetIC5_1: IC6.34(P1.0) ; port P1.0
NetIC5_5: IC6.35(P1.1) ; port P1.1
NetIC6_1: IC6.1(P0.5) ; port P0.5
NetIC6_13: IC6.13(P5.3) ; port P5.3
NetIC6_14: IC6.14(P5.4) ; port P5.4
NetIC6_15: IC6.15(P5.5) ; port P5.5
NetIC6_17: IC6.17(P0.0) ; port P0.0
NetIC6_18: IC6.18(P0.2) ; port P0.2
NetIC6_19: IC6.19(P5.6) ; port P5.6
NetIC6_20: IC6.20(P5.7) ; port P5.7
NetIC6_21: IC6.21(P0.1) ; port P0.1
NetIC6_22: IC6.22(P2.0) ; port P2.0
NetIC6_23: IC6.23(P2.1) ; port P2.1
NetIC6_24: IC6.24(P2.2) ; port P2.2
NetIC6_27: IC6.27(P2.3) ; port P2.3
NetIC6_28: IC6.28(P2.4) ; port P2.4
NetIC6_29: IC6.29(P2.5) ; port P2.5
NetIC6_58: IC6.58(MBC) ; port MBC
NetIC6_59: IC6.59(P4.0) ; port P4.0
NetIC6_60: IC6.60(P4.1) ; port P4.1
NetIC6_61: IC6.61(P4.2) ; port P4.2
NetIC6_63: IC6.63(P0.3) ; port P0.3
NetIC6_64: IC6.64(P0.4) ; port P0.4

Not connected (* = marked no-connect by the designer): IC6 2(P0.6) 8(P5.0) 9(P5.1) 10(P1.6) 11(P1.7) 12(P5.2) 30(P2.6) 32(VAREF) 33(P2.7) 36(P1.2) 37(P1.3) 38(P1.4) 39(P1.5) 40(P4.3) 41(P3.6) 42(P3.7) 43(P3.0) 44(P3.1) 45(P4.4) 46(P4.5) 47(P4.6) 48(P4.7) 51(P3.4) 52(P3.5) 56(NC0) 57(NC1) 62(P0.7)

### Notes on the sheet
- XC888 µC

### Library data of the parts
C11 = C0805C224K5RACTU: 0805 C 220nF Ceramic Multilayer Capacitor; 50 VDC; +125degC; X7R Dielec; +/-10%; Manufacturer: KEMET; Voltage Rating: 50V; Tolerance: 10%; Dissipation Factor: 2.5%; Supplier 1: RSComponents; Manufacturer Part Number: C0805C224K5RACTU; RoHS: Yes; Category: Ceramic Capacitors; Stock 1: 18500; Pricing 1: 500=0,04800, 2500=0,03900 (USD); Mount: Surface Mount,PCB; Case/Package: 0805; Case Code (Metric): 2012; Case Code (Imperial): 0805; Dielectric Material: Ceramic; Min Operating Temperature: -55°C; Max Operating Temperature: 125°C; Package Quantity: 1; Capacitance: 220nF; Packaging: Tape and Reel; Voltage Rating (DC): 50V; Dielectric: X7R; Termination: SMD/SMT; Voltage: 50V; Series: C; Construction: Flat; Length: 2mm; Width: 0.049inch; Height: 1.1mm; Thickness: 0.055inch; Lead Pitch: 0.75mm; Depth: 1.25mm; Radiation Hardening: No; REACH SVHC: No SVHC; RoHS Compliant: Yes; ComponentLink1URL: https://datasheet.ciiva.com/7842/kem-c1002-x7r-smd-7842582.pdf?src-supplier=Element14; ComponentLink1Description: https://datasheet.ciiva.com/7842/kem-c1002-x7r-smd-7842582.pdf?src-supplier=Element14; ComponentLink2URL: https://datasheet.ciiva.com/18193/getdatasheetpartid-304413-18193686.pdf?src-supplier=Verical; ComponentLink2Description: https://datasheet.ciiva.com/18193/getdatasheetpartid-304413-18193686.pdf?src-supplier=Verical; Supplier Part Number 1: 8029927
IC6 = XC8888FFI5VACFXUMA1: MCU 8-Bit XC800 8051 CISC 32KB Flash 2.5V/5V 64-Pin LQFP T/R; Manufacturer: Infineon; RAM Size: 1.75KB; Number of Timers/Counters: 4; Max Supply Voltage: 5.5V; Min Supply Voltage: 2.3V; Interface: UART,USART,SPI; Data Bus Width: 8b; Number of Programmable I/O: 48; Watchdog Timer: Yes; Max Frequency: 24MHz; Operating Supply Voltage: 5V; Peripherals: Brown-out Detect/Reset,POR,PWM,WDT; Oscillator Type: Internal; Core Architecture: 8051; Supplier 1: Digi-Key; Manufacturer Part Number: XC8888FFI5VACFXUMA1; RoHS: Yes; Category: Microcontrollers; Pricing 1: 1900=2,88420 (USD); Case/Package: TQFP; Number of Pins: 64; Min Operating Temperature: -40°C; Max Operating Temperature: 85°C; Packaging: Tape and Reel; Memory Type: FLASH; Memory Size: 32KB; Package Quantity: 1900; Series: XC8xx; Halogen Free: Halogen Free; RoHS Compliant: Yes; ComponentLink1URL: https://www.verical.com/server-webapp/html/getDatasheet?partID=753198&src-supplier=Verical; ComponentLink1Description: https://www.verical.com/server-webapp/html/getDatasheet?partID=753198&src-supplier=Verical; ComponentLink2URL: http://components.arrow.com/part/dataview/0323_00171966?src-supplier=Arrow+Europe; ComponentLink2Description: http://components.arrow.com/part/dataview/0323_00171966?src-supplier=Arrow+Europe; ComponentLink3URL: http://components.arrow.com/part/dataview/52118966S8474747N2051?src-supplier=Arrow+Electronics; ComponentLink3Description: http://components.arrow.com/part/dataview/52118966S8474747N2051?src-supplier=Arrow+Electronics; ComponentLink4URL: https://www.infineon.com/dgdl/Infineon-XC88XCLM-DS-v01_02-en.pdf?fileId=db3a304412b407950112b40c4a9e0afb&src-supplier=Digi-Key; ComponentLink4Description: https://www.infineon.com/dgdl/Infineon-XC88XCLM-DS-v01_02-en.pdf?fileId=db3a304412b407950112b40c4a9e0afb&src-supplier=Digi-Key; ComponentLink5URL: http://www.infineon.com/dgdl/Infineon-XC88XCLM-DS-v01_02-en.pdf?fileId=db3a304412b407950112b40c4a9e0afb&ack=t&src-supplier=Avnet+Europe; ComponentLink5Description: http://www.infineon.com/dgdl/Infineon-XC88XCLM-DS-v01_02-en.pdf?fileId=db3a304412b407950112b40c4a9e0afb&ack=t&src-supplier=Avnet+Europe; ComponentLink6URL: http://www.infineon.com/dgdl/Infineon-XC88XCLM-DS-v01_02-en.pdf?fileId=db3a304412b407950112b40c4a9e0afb&ack=t&src-supplier=Avnet; ComponentLink6Description: http://www.infineon.com/dgdl/Infineon-XC88XCLM-DS-v01_02-en.pdf?fileId=db3a304412b407950112b40c4a9e0afb&ack=t&src-supplier=Avnet; Supplier Part Number 1: XC8888FFI5VACFXUMA1TR-ND